# EAGLE schematic controller (EAGLE 8.7.0)
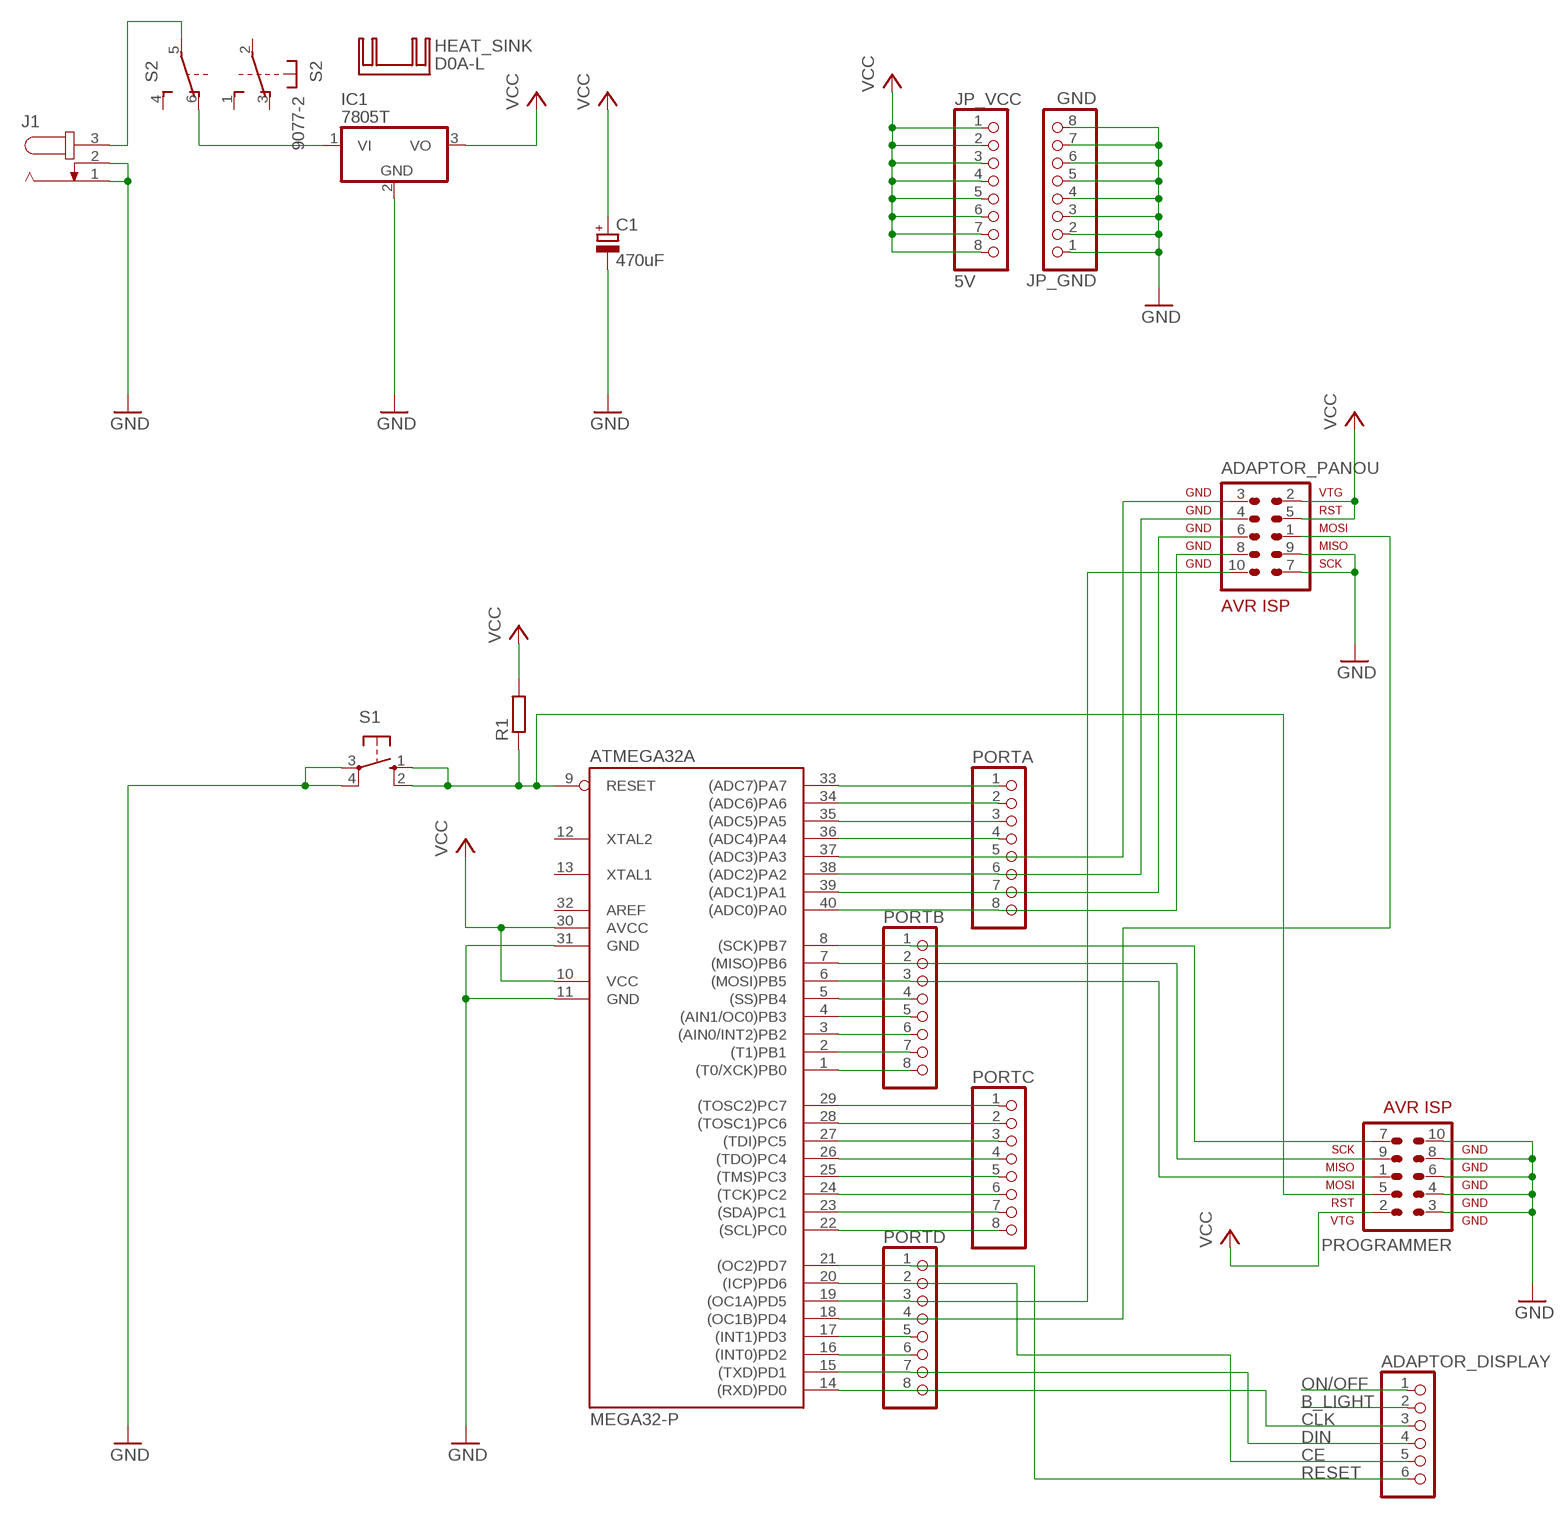
[diagram p0: schematic, sheet 1]

## Parts
ADAPTOR_DISPLAY  PINHD-1X6  [1X06]
ADAPTOR_PANOU  AVR-ISP-10  [AVR-ISP-10]
ATMEGA32A  MEGA32-P  [DIL40]
C1  470uF  CPOL-EUE3.5-8  [E3,5-8]
HEAT_SINK  D0A-L  [D02A-L]
IC1  7805T  [TO220H]
J1  JACK-PLUG0  [SPC4077]
JP_GND  GND  PINHD-1X8  [1X08]
JP_VCC  5V  PINHD-1X8  [1X08]
PORTA  PINHD-1X8  [1X08]
PORTB  PINHD-1X8  [1X08]
PORTC  PINHD-1X8  [1X08]
PORTD  PINHD-1X8  [1X08]
PROGRAMMER  AVR-ISP-10  [AVR-ISP-10]
R1  R-EU_0207/10  [0207/10]
S1  10-XX  [B3F-10XX]
S2  9077-2  [9077-2]

## Nets
B_LIGHT: ADAPTOR_DISPLAY.2
CE: ADAPTOR_DISPLAY.5 ATMEGA32A.20((ICP)PD6) PORTD.2
CLK: ADAPTOR_DISPLAY.3 ATMEGA32A.14((RXD)PD0) PORTD.8
DIN: ADAPTOR_DISPLAY.4 ATMEGA32A.15((TXD)PD1) PORTD.7
GND: ADAPTOR_PANOU.7 ADAPTOR_PANOU.9 ATMEGA32A.11(GND) ATMEGA32A.31(GND) C1.- IC1.2(GND) J1.1 J1.2 JP_GND.1 JP_GND.2 JP_GND.3 JP_GND.4 JP_GND.5 JP_GND.6 JP_GND.7 JP_GND.8 PROGRAMMER.3 PROGRAMMER.4 PROGRAMMER.6 PROGRAMMER.8 PROGRAMMER.10 S1.3(P) S1.4(P1)
N$1: ATMEGA32A.9(RESET) PROGRAMMER.5 R1.1 S1.1(S) S1.2(S1)
N$3: J1.3 S2.5(2:P)
N$5: ATMEGA32A.16((INT0)PD2) PORTD.6
N$6: ATMEGA32A.17((INT1)PD3) PORTD.5
N$7: ADAPTOR_PANOU.1 ATMEGA32A.18((OC1B)PD4) PORTD.4
N$8: ADAPTOR_PANOU.10 ATMEGA32A.19((OC1A)PD5) PORTD.3
N$11: ATMEGA32A.22((SCL)PC0) PORTC.8
N$12: ATMEGA32A.23((SDA)PC1) PORTC.7
N$13: ATMEGA32A.24((TCK)PC2) PORTC.6
N$14: ATMEGA32A.25((TMS)PC3) PORTC.5
N$15: ATMEGA32A.26((TDO)PC4) PORTC.4
N$16: ATMEGA32A.27((TDI)PC5) PORTC.3
N$17: ATMEGA32A.28((TOSC1)PC6) PORTC.2
N$18: ATMEGA32A.29((TOSC2)PC7) PORTC.1
N$19: ATMEGA32A.1((T0/XCK)PB0) PORTB.8
N$20: ATMEGA32A.2((T1)PB1) PORTB.7
N$21: ATMEGA32A.3((AIN0/INT2)PB2) PORTB.6
N$22: ATMEGA32A.4((AIN1/OC0)PB3) PORTB.5
N$23: ATMEGA32A.5((SS)PB4) PORTB.4
N$24: ATMEGA32A.6((MOSI)PB5) PORTB.3 PROGRAMMER.1
N$25: ATMEGA32A.7((MISO)PB6) PORTB.2 PROGRAMMER.9
N$26: ATMEGA32A.8((SCK)PB7) PORTB.1 PROGRAMMER.7
N$27: ADAPTOR_PANOU.8 ATMEGA32A.40((ADC0)PA0) PORTA.8
N$28: ADAPTOR_PANOU.6 ATMEGA32A.39((ADC1)PA1) PORTA.7
N$29: ADAPTOR_PANOU.4 ATMEGA32A.38((ADC2)PA2) PORTA.6
N$30: ADAPTOR_PANOU.3 ATMEGA32A.37((ADC3)PA3) PORTA.5
N$31: ATMEGA32A.36((ADC4)PA4) PORTA.4
N$32: ATMEGA32A.35((ADC5)PA5) PORTA.3
N$33: ATMEGA32A.34((ADC6)PA6) PORTA.2
N$34: ATMEGA32A.33((ADC7)PA7) PORTA.1
N$35: IC1.1(VI) S2.6(2:O)
ON/OFF: ADAPTOR_DISPLAY.1
RESET: ADAPTOR_DISPLAY.6 ATMEGA32A.21((OC2)PD7) PORTD.1
VCC: ADAPTOR_PANOU.2 ADAPTOR_PANOU.5 ATMEGA32A.10(VCC) ATMEGA32A.30(AVCC) C1.+ IC1.3(VO) JP_VCC.1 JP_VCC.2 JP_VCC.3 JP_VCC.4 JP_VCC.5 JP_VCC.6 JP_VCC.7 JP_VCC.8 PROGRAMMER.2 R1.2
Unconnected: ATMEGA32A.12(XTAL2) ATMEGA32A.13(XTAL1) ATMEGA32A.32(AREF) S2.1(1:S) S2.2(1:P) S2.3(1:O) S2.4(2:S)

## Library data of the parts
ADAPTOR_DISPLAY = pinhead:PINHD-1X6: PIN HEADER
ADAPTOR_PANOU PROGRAMMER = avr-7:AVR-ISP-10: AVR ISP-10 Serial Programming Header
ATMEGA32A = atmel:MEGA32-P: MICROCONTROLLER 32 Kbytes FLASH 2 Kbytes SRAM 1 Kbytes EEPROM USART 8-channel 10 bit ADC Source: www.atmel.com .. doc2503.pdf; MPN: ATMEGA32-16PU; OC_FARNELL: 1661729; OC_NEWARK: 51P1794
C1 = rcl:CPOL-EU: POLARIZED CAPACITOR, European symbol; SPICEPREFIX: C
HEAT_SINK = heatsink:D0A-L: HEATSINK distributor Schukat
IC1 = linear:78*: Positive VOLTAGE REGULATOR Source: http://cache.national.com/ds/LM/LM78L05.pdf http://www.fairchildsemi.com/ds/LM/LM7805.pdf
J1 = con-jack:JACK-PLUG: DC POWER JACK Power Jack, DC, Right Angle, Through Hole, Rated 5A at 16VDC, PC Terminals Distributor: Farnell (www.Farnell.de) Drawing: 84N1161.pdf / 84N1162.pdf Manufacturer: SPC Technology (www.spctechnology.com) Type: SPC4077 / SPC 4078; OC_FARNELL: unknown; OC_NEWARK: unknown
JP_GND JP_VCC PORTA PORTB PORTC PORTD = pinhead:PINHD-1X8: PIN HEADER
R1 = rcl:R-EU_: RESISTOR, European symbol; SPICEPREFIX: R
S1 = switch-omron:10-XX: OMRON SWITCH; MPN: B3F-1000; OC_FARNELL: 176432; OC_NEWARK: 36M3542
S2 = switch-misc:9077-2: MARQUARDT SWITCH 9077.0200 Distributor: Buerklin <https://www.buerklin.com/default.asp?event=ShowArtikel%2812G2822%29&l=d&jump=ArtNr_12G2822>